# EAGLE design 9DoF_Sensor_Stick (EAGLE 6.5.0)
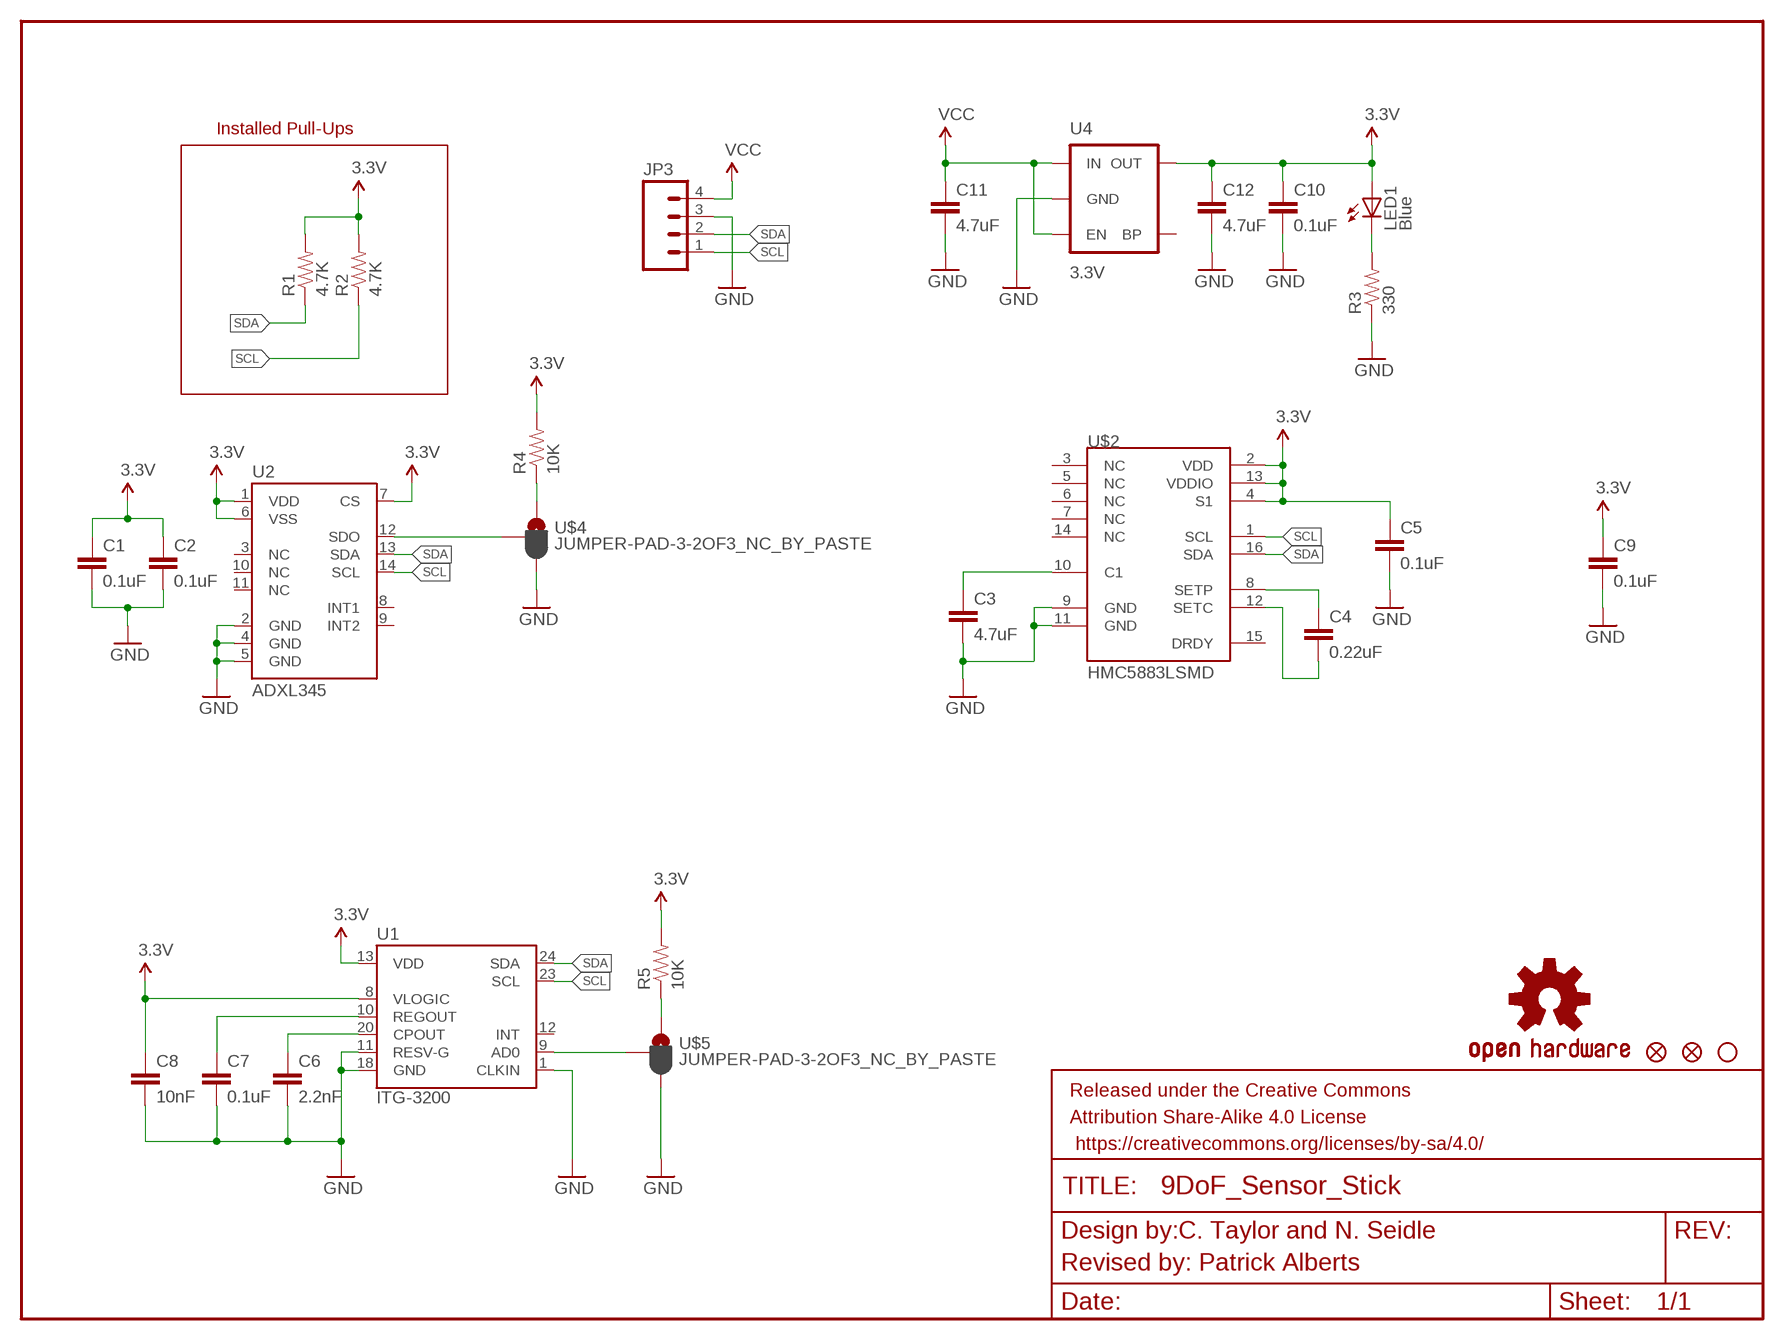
[diagram p0: schematic, sheet 1]

## Parts
C1  0.1uF  0.1UF-25V(+80/-20%)(0603)  [0603-CAP]
C2  0.1uF  0.1UF-25V(+80/-20%)(0603)  [0603-CAP]
C3  4.7uF  4.7UF-6.3V-10%(0603)0603  [0603-CAP]
C4  0.22uF  0.22UF-25V-10%(0603)  [0603-CAP]
C5  0.1uF  0.1UF-25V(+80/-20%)(0603)  [0603-CAP]
C6  2.2nF  2.2NF/2200PF-50V-10%(0603)  [0603-CAP]
C7  0.1uF  0.1UF-25V(+80/-20%)(0603)  [0603-CAP]
C8  10nF  10NF/10000PF-50V-10%(0603)  [0603-CAP]
C9  0.1uF  0.1UF-25V(+80/-20%)(0603)  [0603-CAP]
C10  0.1uF  0.1UF-25V(+80/-20%)(0603)  [0603-CAP]
C11  4.7uF  4.7UF-6.3V-10%(0603)0603  [0603-CAP]
C12  4.7uF  4.7UF-6.3V-10%(0603)0603  [0603-CAP]
FRAME1  FRAME-LETTER  [CREATIVE_COMMONS]
JP1  FIDUCIAL1X2  [FIDUCIAL-1X2]
JP2  FIDUCIAL1X2  [FIDUCIAL-1X2]
JP3  M04PTH  [1X04]
JP5  STAND-OFF  [STAND-OFF]
LED1  Blue  LED0603  [LED-0603]
R1  4.7K  4.7KOHM1/10W1%(0603)  [0603]
R2  4.7K  4.7KOHM1/10W1%(0603)  [0603]
R3  330  330OHM1/10W1%(0603)  [0603-RES]
R4  10K  10KOHM1/10W1%(0603)0603  [0603-RES]
R5  10K  10KOHM1/10W1%(0603)0603  [0603-RES]
U1  ITG-3200  [QFN-24]
U2  ADXL345  [LGA14]
U4  3.3V  V_REG_LDOSMD  [SOT23-5]
U$2  HMC5883LSMD  [16LPCC]
U$3  OSHW-LOGOS  [OSHW-LOGO-S]
U$4  JUMPER-PAD-3-2OF3_NC_BY_PASTE  [PAD-JUMPER-3-2OF3_NC_BY_PASTE_YES_SILK_FULL_BOX]
U$5  JUMPER-PAD-3-2OF3_NC_BY_PASTE  [PAD-JUMPER-3-2OF3_NC_BY_PASTE_YES_SILK_FULL_BOX]

## Nets
3.3V: C1.1 C2.1 C5.1 C8.1 C9.1 C10.1 C12.1 LED1.A R1.2 R2.2 R4.2 R5.2 U1.8(VLOGIC) U1.13(VDD) U2.1(VDD) U2.6(VSS) U2.7(CS) U4.5(OUT) U$2.2(VDD) U$2.4(S1) U$2.13(VDDIO)
GND: C1.2 C2.2 C3.2 C5.2 C6.2 C7.2 C8.2 C9.2 C10.2 C11.2 C12.2 JP3.3 R3.1 U1.1(CLKIN) U1.11(RESV-G) U1.18(GND) U2.2(GND) U2.4(GND) U2.5(GND) U4.2(GND) U$2.9(GND) U$2.11(GND) U$4.3 U$5.3
N$1: C3.1 U$2.10(C1)
N$2: C4.1 U$2.8(SETP)
N$3: C4.2 U$2.12(SETC)
N$4: LED1.C R3.2
N$5: C6.1 U1.20(CPOUT)
N$6: U2.12(SDO) U$4.2
N$7: C7.1 U1.10(REGOUT)
N$8: R4.1 U$4.1
N$9: R5.1 U$5.1
N$10: U1.9(AD0) U$5.2
SCL: JP3.1 R2.1 U1.23(SCL) U2.14(SCL) U$2.1(SCL)
SDA: JP3.2 R1.1 U1.24(SDA) U2.13(SDA) U$2.16(SDA)
VCC: C11.1 JP3.4 U4.1(IN) U4.3(EN)
Unconnected: U1.12(INT) U2.3(NC) U2.8(INT1) U2.9(INT2) U2.10(NC) U2.11(NC) U4.4(BP) U$2.3(NC) U$2.5(NC) U$2.6(NC) U$2.7(NC) U$2.14(NC) U$2.15(DRDY)

## Notes on the sheet
- Installed Pull-Ups
- C. Taylor and N. Seidle
- Revised by: Patrick Alberts

## Library data of the parts
C1 C2 C5 C7 C9 C10 = SparkFun-Capacitors:0.1UF-25V(+80/-20%)(0603): CAP-00810 Ceramic Standard decoupling cap; PROD_ID: CAP-00810
C3 C11 C12 = SparkFun-Capacitors:4.7UF-6.3V-10%(0603): CAP-08280; PROD_ID: CAP-08280
C4 = SparkFun-Capacitors:0.22UF-25V-10%(0603): CAP-07822; PROD_ID: CAP-07822
C6 = SparkFun-Capacitors:2.2NF/2200PF-50V-10%(0603): CAP-07877; PROD_ID: CAP-07877
C8 = SparkFun-Capacitors:10NF/10000PF-50V-10%(0603): CAP-00867; PROD_ID: CAP-00867
FRAME1 = SparkFun-Aesthetics:FRAME-LETTER: Schematic Frame Standard 8.5x11 US Letter frame
JP1 JP2 = SparkFun:FIDUCIAL: Fiducial Alignment Points Various fiducial points for machine vision alignment.
JP3 = SparkFun:M04: Header 4 Standard 4-pin 0.1" header. Use with straight break away headers (SKU : PRT-00116), right angle break away headers (PRT-00553), swiss pins (PRT-00743), machine pins (PRT-00117), and female headers (PRT-00115). Molex polarized connector foot print use with SKU : PRT-08231 with associated crimp pins and housings.
JP5 = SparkFun:STAND-OFF: Stand Off This is the mechanical footprint for a #4 phillips button head screw. Use the keepout ring to avoid running the screw head into surrounding components. SKU : PRT-00447
LED1 = SparkFun:LED: LEDs Standard schematic elements and footprints for 5mm, 3mm, 1206, and 0603 sized LEDs. 5mm - Spark Fun Electronics SKU : COM-00529 (and others)
R1 R2 = SparkFun-Resistors:4.7KOHM1/10W1%(0603): RES-07857; PROD_ID: RES-07857
R3 = SparkFun-Resistors:330OHM1/10W1%(0603): RES-00818; PROD_ID: RES-00818
R4 R5 = SparkFun-Resistors:10KOHM1/10W1%(0603): RES-00824; PROD_ID: RES-00824
U1 = SparkFun:ITG-3200: ITG-3200 3-axis gyro, digital output, qfn24 package
U2 = SparkFun:ADXL345
U4 = SparkFun:V_REG_LDO: Voltage Regulator LDO Standard 150mA LDO voltage regulator in SOT-23 layout. Micrel part MIC5205. BP (by-pass) pin is used to lower output noise with 470pF cap.
U$2 = SparkFun:HMC5883L: 3 Axis Digital Compass IC
U$3 = SparkFun:OSHW-LOGO: Open Source Hardware Logo This logo indicates the piece of hardware it is found on incorporates a OSHW license and/or adheres to the definition of open source hardware found here: http://freedomdefined.org/OSHW
U$4 U$5 = SparkFun-Passives:JUMPER-PAD-3-2OF3_NC_BY_PASTE

## Board
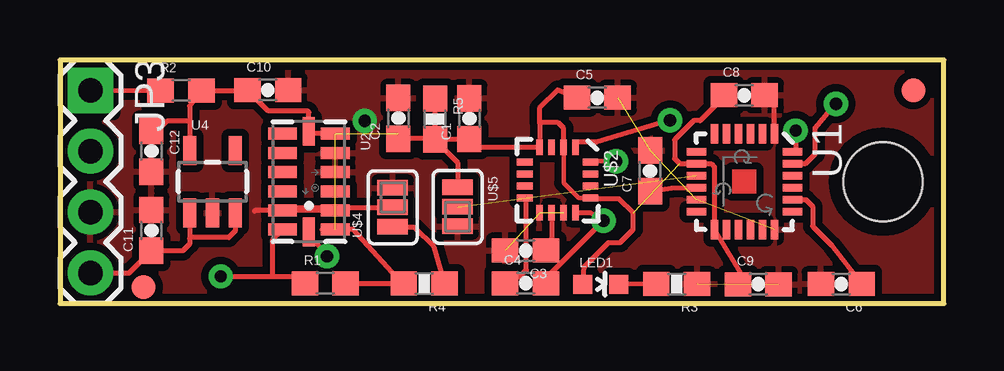
[diagram p1: board, top side]
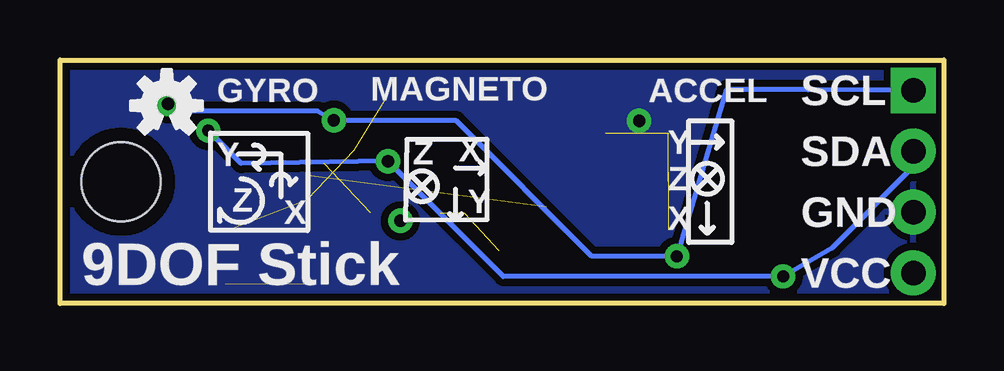
[diagram p2: board, bottom side, seen from below]

Size 36.83 x 10.16 mm. Coordinates in mm from the lower left corner, seen from the top.
Outline: 0,0 36.83,0 36.83,10.16 0,10.16 0,0
Copper layers (1*16): Top 0.035mm / dielectric 1.5mm / Bottom 0.035mm
Design rules "SparkFun *": minimum track width 7mil, minimum drill 20mil, track to track 8mil, track to pad 8mil, pad to pad 7mil, via to via 8mil, smd to smd 8mil, copper to edge 8mil, drill to drill 8mil, minimum pad ring 12mil, minimum via ring 10mil, stop-mask expansion 4mil, vias tented up to drill 20mil, thermal gap 10mil

### Footprints (pad centres in the part's own frame; a part is rotated, then mirrored left to right if it is on the bottom)
0603-CAP = smd 1.1 x 1: 1 -0.85,0; 2 0.85,0
FIDUCIAL-1X2 = smd 1 x 1: 1 0,0
1X04 = drill 1.016 pad 1.88 square: 1 0,0 | drill 1.016 pad 1.88: 2 2.54,0; 3 5.08,0; 4 7.62,0
STAND-OFF = hole 3.302: 0,0
LED-0603 = smd 0.8 x 0.8: A 0,-0.75; C 0,0.75
0603 = smd 1.1 x 1: 1 -0.85,0; 2 0.85,0
0603-RES = smd 1.1 x 1: 1 -0.85,0; 2 0.85,0
QFN-24 = smd 0.8 x 0.3: 1 -2,1.25; 2 -2,0.75; 3 -2,0.25; 4 -2,-0.25; 5 -2,-0.75; 6 -2,-1.25; 13 2,-1.25; 14 2,-0.75; 15 2,-0.25; 16 2,0.25; 17 2,0.75; 18 2,1.25 | smd 0.3 x 0.8: 7 -1.25,-2; 8 -0.75,-2; 9 -0.25,-2; 10 0.25,-2; 11 0.75,-2; 12 1.25,-2; 19 1.25,2; 20 0.75,2; 21 0.25,2; 22 -0.25,2; 23 -0.75,2; 24 -1.25,2
LGA14 = smd 0.5 x 1.2: 1 2,1.1; 2 1.2,1.1; 3 0.4,1.1; 4 -0.4,1.1; 5 -1.2,1.1; 6 -2,1.1; 8 -2,-1.1; 9 -1.2,-1.1; 10 -0.4,-1.1; 11 0.4,-1.1; 12 1.2,-1.1; 13 2,-1.1 | smd 1.2 x 0.5: 7 -2.1,0; 14 2.1,0
SOT23-5 = smd 0.55 x 1.2: 1 -0.95,-1.3; 2 0,-1.3; 3 0.95,-1.3; 4 0.95,1.3; 5 -0.95,1.3
16LPCC = smd 0.65 x 0.28: 1 -1.37,0.75; 2 -1.37,0.25; 3 -1.37,-0.25; 4 -1.37,-0.75; 9 1.37,-0.75; 10 1.37,-0.25; 11 1.37,0.25; 12 1.37,0.75 | smd 0.28 x 0.65: 5 -0.75,-1.37; 6 -0.25,-1.37; 7 0.25,-1.37; 8 0.75,-1.37; 13 0.75,1.37; 14 0.25,1.37; 15 -0.25,1.37; 16 -0.75,1.37
PAD-JUMPER-3-2OF3_NC_BY_PASTE_YES_SILK_FULL_BOX = smd 0.635 x 1.27: 1 -0.813,0; 2 0,0; 3 0.813,0

### Placement (x,y rotation side)
C1  17.06,7.71 90 top
C2  14.1,7.72 90 top
C3  19.4,2.21 180 top
C4  19.4,0.85 0 top
C5  22.39,8.58 0 top
C6  32.56,0.82 180 top
C7  24.59,5.53 90 top
C8  28.51,8.68 0 top
C9  29.1,0.81 0 top
C10  8.66,8.9 0 top
C11  3.81,3.05 90 top
C12  3.81,6.35 270 top
FRAME1  0.78,-13.97 0 top  (outside the outline)
JP1  35.56,8.89 0 top
JP2  3.48,0.69 0 top
JP3  1.27,8.89 270 top
JP5  34.29,5.08 0 top
LED1  22.53,0.8 270 top
R1  11.05,0.83 0 top
R2  5.04,8.87 0 top
R3  25.69,0.81 180 top
R4  15.17,0.83 180 top
R5  15.63,7.7 270 top
U1  28.52,5.08 270 top
U2  10.37,5.08 270 top
U4  6.35,5.08 0 top
U$2  20.73,5.15 270 top
U$3  32.38,8.26 0 bottom
U$4  13.86,4.01 90 top
U$5  16.57,4.03 270 top

### Tracks (layer width: path | path; a pad name or v marks a point on that pad's centre or on a via)
3.3V  (3 unrouted)
  Top 0.178: U$2.2 20.98,5.03 21.61,4.4 U$2.13
  Top 0.203: 10.91,3.08 U2.1 12.22,3.08 14.25,0.83 R4.2 R1.2 | C1.1 17.06,6.56 16.93,6.44 | C12.1 3.81,6.96 4.47,7.62 5.4,7.62 | U2.6 11.44,7.11 10.42,7.11 U2.7 10.37,7.98 10.32,8.03 8.68,8.03 C10.1 7.79,8.88 R2.2 5.4,8.23 5.4,7.62 | 5.4,7.62 U4.5 | 19.98,7.54 U$2.4 17.4,6.52 C1.1 | U$2.2 20.98,7.31 20.76,7.54 19.98,7.54 | U2.6 10.95,7.08 | C9.1 28.49,1.05 U1.13 27.27,5.7 27.13,5.83 U1.8 25.82,5.83 25.61,6.04 25.61,6.83 26.4,7.62 26.67,7.62 27.67,8.62 C8.1 | LED1.A 21.84,1.52 22.86,2.54 23.34,2.54 23.88,3.08 23.88,3.77 23.29,4.36 22.14,4.36 U$2.13 | C5.1 20.74,8.91 19.97,8.14 19.97,7.55 19.98,7.54 | U2.6 | 14.1,7.08 C2.1 15.6,6.87 R5.2 C1.1
GND  (via drill 0.51)  (7 unrouted)
  Top 0.203: U2.2 8.14,3.88 8.11,3.85 | U1.1 29.77,8.27 C8.2
  other vias: 12.7,7.62
  pour Bottom (isolate 0.305): 0,10.16 0,0 36.83,0 36.83,10.16
  pour Top (isolate 0.305): 0,10.16 0,0 36.83,0 36.83,10.16
N$1
  Top 0.203: U$2.10 20.48,2.7 C3.1
N$2
  Top 0.203: U$2.8 | U$2.8 | C4.1 18.52,1.11 19.14,1.11 19.43,1.4 19.43,4.33 U$2.8
N$3  (via drill 0.51)
  Top 0.203: U$2.12 21.5,3.78 22.11,3.78 v22.64,3.45 20.3,1.11 C4.2
N$4
  Top 0.203: R3.2 LED1.C
N$5
  Top 0.203: C6.1 33.38,0.84 32.16,2.42 31.36,3.22 31.36,4.05 31.07,4.33 U1.20
N$6
  Top 0.203: U2.12 9.4,4.01 U$4.2
N$7
  Top 0.203: U1.10 25.48,4.81 C7.1
N$8
  Top 0.203: R4.1 15.59,2.35 14.77,3.17 13.89,3.17 U$4.1
N$9
  Top 0.203: U$5.1 16.57,5.88 15.62,6.83 15.62,8.54 R5.1
N$10  (1 unrouted)
SCL  (via drill 0.51)
  Top 0.203: JP3.1 R2.1 | v25.42,7.64 22.36,6.72 21.55,6.72 21.5,6.67 21.5,6.52 U$2.1 | U1.23 30.55,5.84 31.08,5.84 31.46,6.22 31.46,7.32 v32.33,8.33 | v11.13,1.97 10.73,2.49 10.22,2.49 10.37,2.64 U2.14
  Bottom 0.203: JP3.1 3.15,8.89 5.66,8.91 9.07,8.91 v11.13,1.97 14.67,1.97 20.32,7.62 25.37,7.62 v25.42,7.64 26.09,8.03 31.21,8.03 31.82,7.92 v32.33,8.33
SDA  (via drill 0.51)
  Top 0.203: v23.16,5.93 U$2.16 | v30.65,7.21 30.65,6.4 30.55,6.3 U1.24 | 9.29,3.06 U2.13 9.25,3.05 8.85,2.64 8.85,1.13 | v6.7,1.13 8.85,1.13 | 8.85,1.13 10.12,1.13 R1.1
  Bottom 0.203: v23.16,5.93 29.28,5.84 v30.65,7.21 | 23.12,5.86 v23.16,5.93 | JP3.2 1.27,5.7 4.66,2.31 v6.7,1.13 18.36,1.13 v23.16,5.93 | 23.14,5.94 v23.16,5.93
VCC
  Top 0.203: 3.81,2.54 C11.1 | JP3.4 2.88,1.27 C11.1 | U4.1 5.4,2.7 | 5.4,2.7 5.4,2.48 5.12,2.2 C11.1 | U4.3 7.3,3.02 7.03,2.75 5.45,2.75 5.4,2.7

### Text on the board
bPlace: SCL | ACCEL | MAGNETO | GYRO | SDA | Y | X | Z | Y | Z | Y | Z | GND | X | X | VCC | 9DOF Stick
tDocu: C. Taylor and N. Seidle | Revised by: Patrick Alberts